# Altium schematic sheet Блок4.SchDoc
size A4; DocumentNumber: 9; SheetNumber: 9; SheetTotal: 12
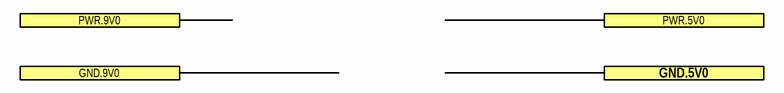
[diagram p0: Блок4.SchDoc]

## Ports
GND.5V0, GND.9V0, PWR.5V0, PWR.9V0